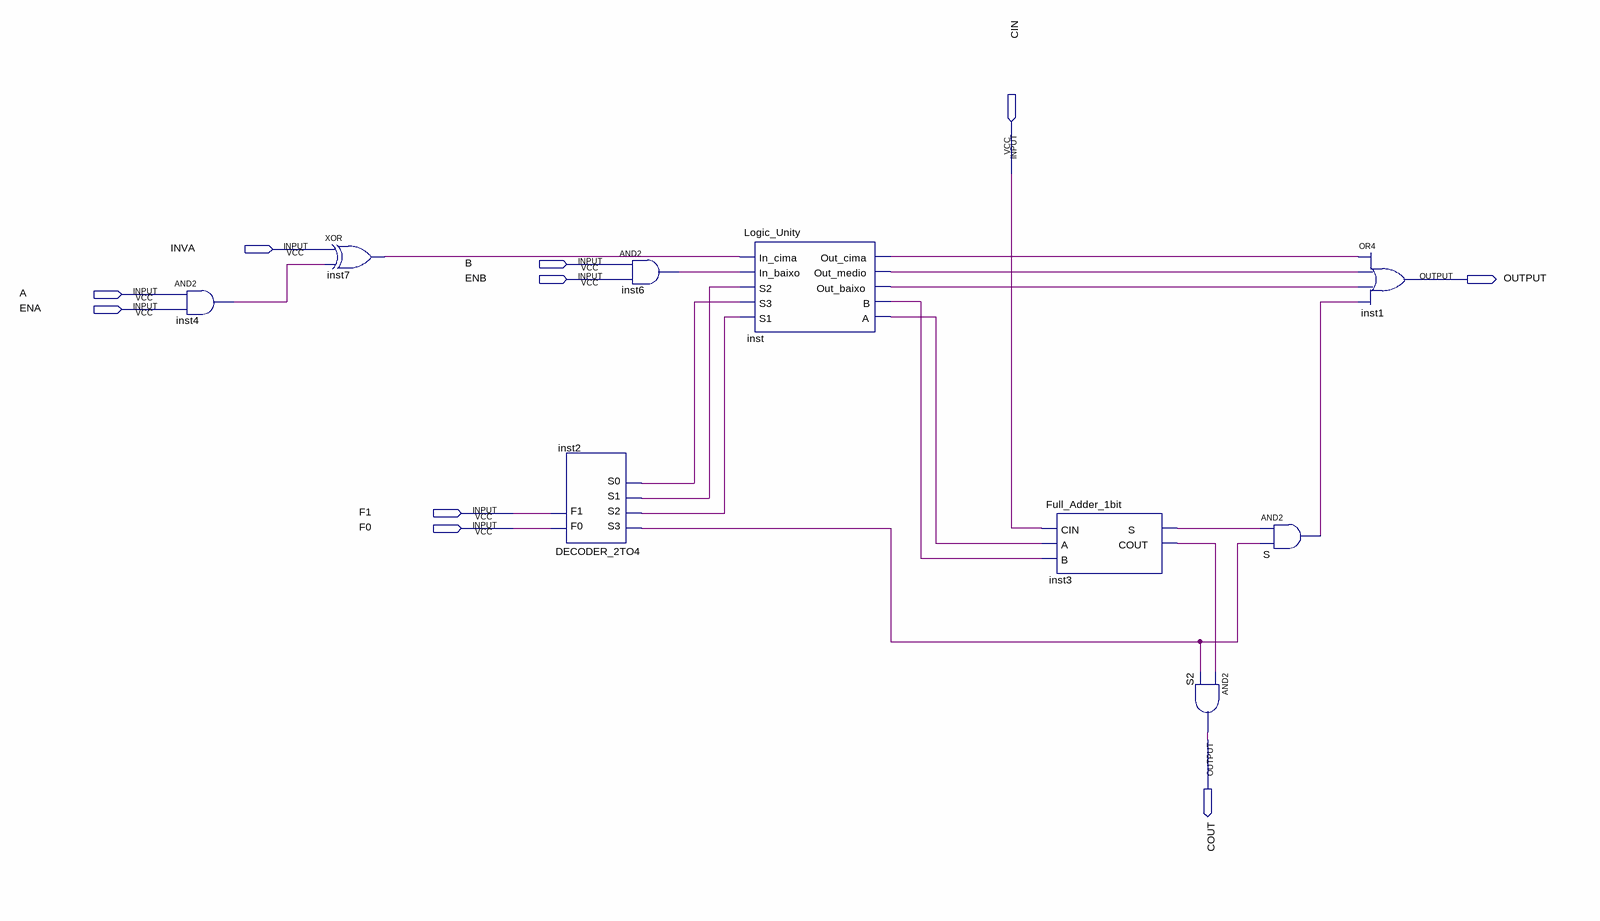
[diagram p0: schematic sheet]
// Quartus schematic ULA_1bit.bdf as structural Verilog: 9 symbols, 10 pins
module ULA_1bit (
  input  CIN,
  input  INVA,
  input  B,
  input  ENB,
  input  A,
  input  ENA,
  input  F1,
  input  F0,
  output OUTPUT,
  output COUT
);

  wire inst2_s0, inst2_s1, inst2_s2, inst2_s3, inst3_cout, inst3_s, inst4_out, inst6_out, inst7_out, inst_a,
       inst_b, inst_out_baixo, inst_out_cima, inst_out_medio, S_out;

  and inst4 (inst4_out, A, ENA);
  xor inst7 (inst7_out, INVA, inst4_out);
  DECODER_2TO4 inst2 (.F0(F0), .F1(F1), .S3(inst2_s3), .S2(inst2_s2), .S1(inst2_s1), .S0(inst2_s0));
  and inst6 (inst6_out, B, ENB);
  Logic_Unity inst (
    .In_cima(inst7_out), .In_baixo(inst6_out), .S2(inst2_s1), .S3(inst2_s0), .S1(inst2_s2),
    .Out_cima(inst_out_cima), .Out_medio(inst_out_medio), .Out_baixo(inst_out_baixo), .B(inst_b), .A(inst_a));
  Full_Adder_1bit inst3 (.CIN(CIN), .A(inst_a), .B(inst_b), .S(inst3_s), .COUT(inst3_cout));
  and S2 (COUT, inst3_cout, inst2_s3);
  and S (S_out, inst3_s, inst2_s3);
  or inst1 (OUTPUT, inst_out_cima, inst_out_medio, inst_out_baixo, S_out);
endmodule
